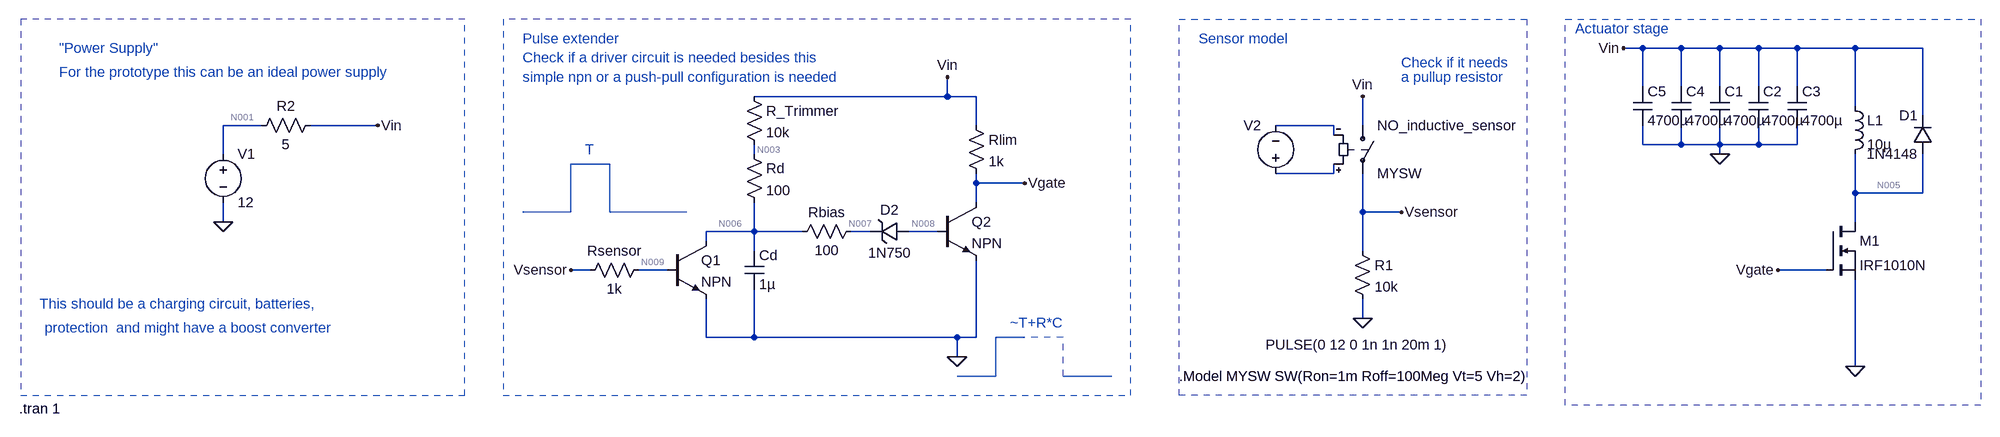
[diagram p0: schematic perpetual_motion.asc]
perpetual_motion.asc, the LTspice schematic file:
Version 4
SHEET 1 3884 12304
WIRE 1584 -160 1552 -160
WIRE 1648 -160 1584 -160
WIRE 1712 -160 1648 -160
WIRE 1776 -160 1712 -160
WIRE 1840 -160 1776 -160
WIRE 1936 -160 1840 -160
WIRE 2048 -160 1936 -160
WIRE 1584 -96 1584 -160
WIRE 1648 -96 1648 -160
WIRE 1712 -96 1712 -160
WIRE 1776 -96 1776 -160
WIRE 1840 -96 1840 -160
WIRE 432 -80 432 -112
WIRE 432 -80 112 -80
WIRE 480 -80 432 -80
WIRE 1936 -64 1936 -160
WIRE 2048 -48 2048 -160
WIRE -704 -32 -768 -32
WIRE -512 -32 -624 -32
WIRE 480 -32 480 -80
WIRE 1072 -32 976 -32
WIRE 1120 -32 1120 -80
WIRE 1072 -16 1072 -32
WIRE 1584 0 1584 -32
WIRE 1648 0 1648 -32
WIRE 1648 0 1584 0
WIRE 1712 0 1712 -32
WIRE 1712 0 1648 0
WIRE 1776 0 1776 -32
WIRE 1776 0 1712 0
WIRE 1840 0 1840 -32
WIRE 1840 0 1776 0
WIRE -768 16 -768 -32
WIRE 112 16 112 0
WIRE 1712 16 1712 0
WIRE 1072 48 1072 32
WIRE 1072 48 976 48
WIRE 480 64 480 48
WIRE 560 64 480 64
WIRE 1936 80 1936 16
WIRE 2048 80 2048 16
WIRE 2048 80 1936 80
WIRE 480 96 480 64
WIRE 1120 112 1120 48
WIRE 1184 112 1120 112
WIRE -768 128 -768 96
WIRE 1936 128 1936 80
WIRE 112 144 112 96
WIRE 112 144 32 144
WIRE 192 144 112 144
WIRE 304 144 272 144
WIRE 416 144 368 144
WIRE 32 160 32 144
WIRE 112 176 112 144
WIRE 1120 176 1120 112
WIRE -160 208 -192 208
WIRE -32 208 -80 208
WIRE 1888 208 1808 208
WIRE 1120 288 1120 256
WIRE 32 320 32 256
WIRE 112 320 112 240
WIRE 112 320 32 320
WIRE 448 320 112 320
WIRE 480 320 480 192
WIRE 480 320 448 320
WIRE 448 352 448 320
WIRE 1936 368 1936 224
FLAG 1936 368 0
FLAG 1712 16 0
FLAG 1552 -160 Vin
FLAG -512 -32 Vin
FLAG 1808 208 Vgate
FLAG -768 128 0
FLAG 1120 -80 Vin
FLAG 1184 112 Vsensor
FLAG 1120 288 0
FLAG -192 208 Vsensor
FLAG 432 -112 Vin
FLAG 448 352 0
FLAG 560 64 Vgate
SYMBOL nmos 1888 128 R0
SYMATTR InstName M1
SYMATTR Value IRF1010N
SYMBOL ind 1920 -80 R0
SYMATTR InstName L1
SYMATTR SpiceLine Rser=2
SYMATTR Value 10µ
SYMBOL diode 2064 16 R180
WINDOW 0 24 64 Left 2
WINDOW 3 24 0 Left 2
SYMATTR InstName D1
SYMATTR Value 1N4148
SYMBOL voltage -768 0 R0
WINDOW 123 0 0 Left 0
WINDOW 39 0 0 Left 0
SYMATTR InstName V1
SYMATTR Value 12
SYMBOL sw 1120 -48 R0
SYMATTR InstName NO_inductive_sensor
SYMATTR Value MYSW
SYMBOL voltage 976 64 R180
WINDOW 0 24 96 Left 2
WINDOW 3 -287 -268 Left 2
WINDOW 123 0 0 Left 0
WINDOW 39 0 0 Left 0
SYMATTR InstName V2
SYMATTR Value PULSE(0 12 0 1n 1n 20m 1)
SYMBOL res 1104 160 R0
SYMATTR InstName R1
SYMATTR Value 10k
SYMBOL res -64 192 R90
WINDOW 0 0 56 VBottom 2
WINDOW 3 32 56 VTop 2
SYMATTR InstName Rsensor
SYMATTR Value 1k
SYMBOL npn -32 160 R0
SYMATTR InstName Q1
SYMBOL cap 96 176 R0
SYMATTR InstName Cd
SYMATTR Value 1µ
SYMBOL res 96 0 R0
SYMATTR InstName Rd
SYMATTR Value 100
SYMBOL res 288 128 R90
WINDOW 0 0 56 VBottom 2
WINDOW 3 32 56 VTop 2
SYMATTR InstName Rbias
SYMATTR Value 100
SYMBOL zener 368 128 R90
WINDOW 0 -4 32 VBottom 2
WINDOW 3 36 32 VTop 2
SYMATTR InstName D2
SYMATTR Value 1N750
SYMBOL npn 416 96 R0
SYMATTR InstName Q2
SYMBOL res 464 -48 R0
SYMATTR InstName Rlim
SYMATTR Value 1k
SYMBOL res 96 -96 R0
SYMATTR InstName R_Trimmer
SYMATTR Value 10k
SYMBOL cap 1632 -96 R0
SYMATTR InstName C4
SYMATTR Value 4700µ
SYMBOL cap 1568 -96 R0
SYMATTR InstName C5
SYMATTR Value 4700µ
SYMBOL res -608 -48 R90
WINDOW 0 0 56 VBottom 2
WINDOW 3 32 56 VTop 2
SYMATTR InstName R2
SYMATTR Value 5
SYMBOL cap 1696 -96 R0
SYMATTR InstName C1
SYMATTR Value 4700µ
SYMBOL cap 1760 -96 R0
SYMATTR InstName C2
SYMATTR Value 4700µ
SYMBOL cap 1824 -96 R0
SYMATTR InstName C3
SYMATTR Value 4700µ
TEXT 1472 -192 Left 2 ;Actuator stage
TEXT -1040 -160 Left 2 ;"Power Supply"
TEXT 1184 -136 Left 2 ;Check if it needs
TEXT 1184 -112 Left 2 ;a pullup resistor
TEXT 848 -176 Left 2 ;Sensor model
TEXT -272 -176 Left 2 ;Pulse extender
TEXT 536 296 Left 2 ;~T+R*C
TEXT -168 8 Left 2 ;T
TEXT -272 -144 Left 2 ;Check if a driver circuit is needed besides this
TEXT -272 -112 Left 2 ;simple npn or a push-pull configuration is needed
TEXT -1040 -120 Left 2 ;For the prototype this can be an ideal power supply
TEXT -1072 264 Left 2 ;This should be a charging circuit, batteries,
TEXT -1064 304 Left 2 ;protection  and might have a boost converter
TEXT 816 384 Left 2 !.Model MYSW SW(Ron=1m Roff=100Meg Vt=5 Vh=2)
TEXT -1106 438 Left 2 !.tran 1
LINE Normal 512 384 448 384
LINE Normal 512 320 512 384
LINE Normal 560 320 512 320
LINE Normal 624 320 560 320 1
LINE Normal 624 384 624 320 1
LINE Normal 704 384 624 384
LINE Normal -192 112 -272 112
LINE Normal -192 32 -192 112
LINE Normal -128 32 -192 32
LINE Normal -128 112 -128 32
LINE Normal 0 112 -128 112
RECTANGLE Normal 2144 432 1456 -208 2
RECTANGLE Normal 1392 416 816 -208 2
RECTANGLE Normal -304 416 736 -208 2
RECTANGLE Normal -1104 416 -368 -208 2

The netlist it stands for:
* perpetual_motion.asc
M1 N005 Vgate 0 0 IRF1010N
L1 Vin N005 10µ Rser=2
D1 N005 Vin 1N4148
V1 N001 0 12
S§NO_inductive_sensor Vin Vsensor N004 N002 MYSW
V2 N004 N002 PULSE(0 12 0 1n 1n 20m 1)
R1 Vsensor 0 10k
Rsensor N009 Vsensor 1k
Q1 N006 N009 0 0 NPN
Cd N006 0 1µ
Rd N003 N006 100
Rbias N007 N006 100
D2 N008 N007 1N750
Q2 Vgate N008 0 0 NPN
Rlim Vin Vgate 1k
R_Trimmer Vin N003 10k
C4 Vin 0 4700µ
C5 Vin 0 4700µ
R2 Vin N001 5
C1 Vin 0 4700µ
C2 Vin 0 4700µ
C3 Vin 0 4700µ
.model D D
.lib standard.dio
.model NPN NPN
.model PNP PNP
.lib standard.bjt
.model NMOS NMOS
.model PMOS PMOS
.lib standard.mos
* Actuator stage
* "Power Supply"
* Check if it needs
* a pullup resistor
* Sensor model
* Pulse extender
* ~T+R*C
* T
* Check if a driver circuit is needed besides this
* simple npn or a push-pull configuration is needed
* For the prototype this can be an ideal power supply
* This should be a charging circuit, batteries,
* protection  and might have a boost converter
.Model MYSW SW(Ron=1m Roff=100Meg Vt=5 Vh=2)
.tran 1
.backanno
.end

* Results of the author's LTspice run, read from the files saved beside the schematic
* Operating Point, zero values left out:
*   V(n005) = 11.94 V
*   V(vgate) = 82.2 mV
*   V(vin) = 11.94 V
*   V(n001) = 12 V
*   V(vsensor) = 1.194 mV
*   V(n009) = 1.194 mV
*   V(n006) = 5.189 V
*   V(n003) = 5.256 V
*   V(n007) = 5.122 V
*   V(n008) = 840.4 mV
*   Ic(Q2) = 11.86 mA
*   Ib(Q2) = 668.2 µA
*   Ie(Q2) = -12.52 mA
*   Ic(Q1) = 5.188 pA
*   Ib(Q1) = -5.187 pA
*   Id(M1) = 14.68 pA
*   Is(M1) = -14.68 pA
*   I(D2) = -668.2 µA
*   I(L1) = 28.1 pA
*   I(R2) = -12.52 mA
*   I(R_trimmer) = 668.2 µA
*   I(Rlim) = 11.86 mA
*   I(Rbias) = -668.2 µA
*   I(Rd) = 668.2 µA
*   I(Rsensor) = 5.187 pA
*   I(R1) = 119.4 nA
*   I(No_inductive_sensor) = -119.4 nA
*   I(V1) = -12.52 mA
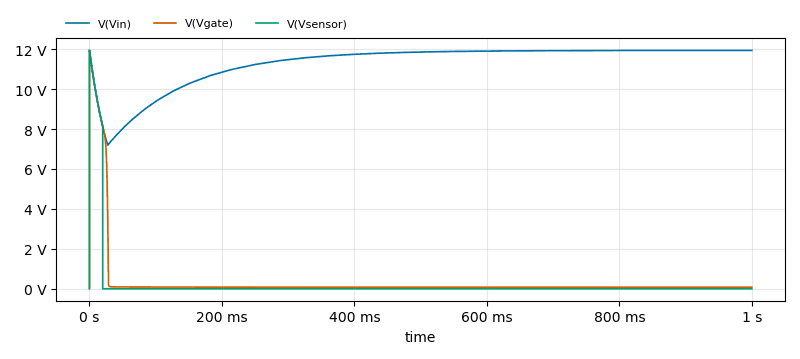
[diagram p1: Transient Analysis of perpetual_motion.asc, plotted from the saved traces]
* Transient Analysis, 1 run:
*   V(Vin): min 7.191 V, max 11.94 V, average 11.31 V, rms 11.36 V, last 11.94 V
*   V(Vgate): min 82.2 mV, max 11.92 V, average 333.3 mV, rms 1.535 V, last 82.2 mV
*   V(Vsensor): min 719.1 µV, max 11.94 V, average 198 mV, rms 1.401 V, last 1.194 mV